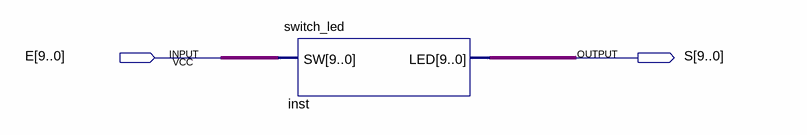
[diagram p0: schematic sheet]
// Quartus schematic LAB1.bdf as structural Verilog: 1 symbols, 2 pins
module LAB1 (
  input  [9:0] E,
  output [9:0] S
);

  switch_led inst (.SW(E), .LED(S));
endmodule
